# Altium schematic sheet hv_psu_v100_CON.SchDoc
size A4; SheetNumber: 7; SheetTotal: 7
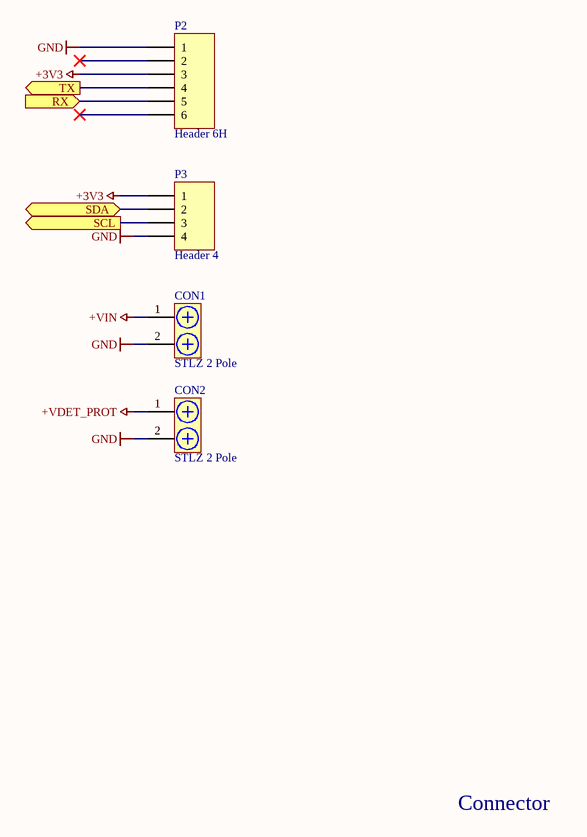
[diagram p0: hv_psu_v100_CON.SchDoc]

## Parts
CON1  STLZ 2 Pole  [CON_STLZ_950WV2 + AKZ 950/2]
CON2  STLZ 2 Pole  [CON_STLZ_950WV2 + AKZ 950/2]
P2  Header 6H  [HDR1X6H]
P3  Header 4  [HDR1X4]

## Ports
RX (in), SCL (out), SDA (bidir), TX (out)

## Nets
+3V3: P2.3 P3.1
+VDET_PROT: CON2.1
+VIN: CON1.1
GND: CON1.2 CON2.2 P2.1 P3.4
RX: P2.5 ; port RX
SCL: P3.3 ; port SCL
SDA: P3.2 ; port SDA
TX: P2.4 ; port TX

Not connected (* = marked no-connect by the designer): P2 2* 6*

## Notes on the sheet
- Connector

## Library data of the parts
P2 = Header 6H: Header, 6-Pin, Right Angle; LatestRevisionDate: 17-Jul-2002; LatestRevisionNote: Re-released for DXP Platform.; Publisher: Altium Limited
P3 = Header 4: Header, 4-Pin; LatestRevisionDate: 17-Jul-2002; LatestRevisionNote: Re-released for DXP Platform.; Publisher: Altium Limited